# Altium project PCB_Project top.PrjPCB
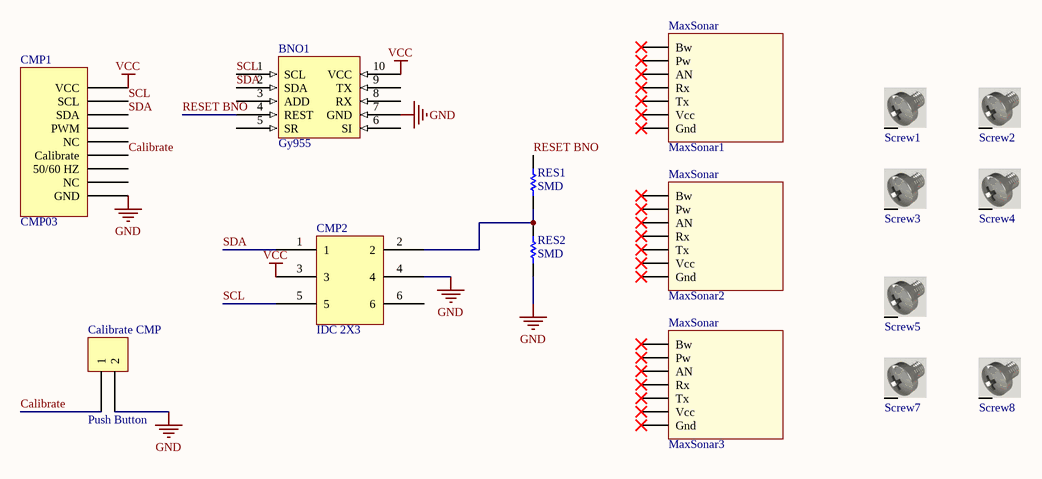
[diagram p0: top.SchDoc]
1 sheet, 16 parts. Net scope: global (net labels, ports and power ports of the same name join across sheets).
Board file: top.PcbDoc

## Sheet top.SchDoc
size A

### Parts
BNO1  Gy955  [DIP10]
Calibrate_CMP  Push Button  [Push Button]
CMP1  CMP03  [CMP03]
CMP2  IDC 2X3  [IDC 2X3]
MaxSonar1  Ultrasonic  [MaxSonar]  (value not drawn)
MaxSonar2  Ultrasonic  [MaxSonar]  (value not drawn)
MaxSonar3  Ultrasonic  [MaxSonar]  (value not drawn)
RES1  SMD  [Resistor SMD 1206]
RES2  SMD  [Resistor SMD 1206]
Screw1  Screw  [Screw]  (value not drawn)
Screw2  Screw  [Screw]  (value not drawn)
Screw3  Screw  [Screw]  (value not drawn)
Screw4  Screw  [Screw]  (value not drawn)
Screw5  Screw  [Screw]  (value not drawn)
Screw7  Screw  [Screw]  (value not drawn)
Screw8  Screw  [Screw]  (value not drawn)

### Nets
GND: BNO1.7(GND) Calibrate_CMP.2 CMP1.9(GND) CMP2.4 RES2.1
VCC: BNO1.10(VCC) CMP1.1(VCC) CMP2.3
Calibrate: Calibrate_CMP.1 CMP1.6(Calibrate)
RESET BNO: BNO1.4(REST) RES1.2
SCL: BNO1.1(SCL) CMP1.2(SCL) CMP2.5
SDA: BNO1.2(SDA) CMP1.3(SDA) CMP2.1
NetCMP2_2: CMP2.2 RES1.1 RES2.2

Not connected (* = marked no-connect by the designer): BNO1 3(ADD) 5(SR) 6(SI) 8(RX) 9(TX); CMP1 4(PWM) 5(NC) 7(50/60_HZ) 8(NC); CMP2 6; MaxSonar1 1(Bw)* 2(Pw)* 3(AN)* 4(Rx)* 5(Tx)* 6(Vcc)* 7(Gnd)*; MaxSonar2 1(Bw)* 2(Pw)* 3(AN)* 4(Rx)* 5(Tx)* 6(Vcc)* 7(Gnd)*; MaxSonar3 1(Bw)* 2(Pw)* 3(AN)* 4(Rx)* 5(Tx)* 6(Vcc)* 7(Gnd)*; Screw1 S; Screw2 S; Screw3 S; Screw4 S; Screw5 S; Screw7 S; Screw8 S

### Library data of the parts
MaxSonar1-MaxSonar3 = MaxSonar
RES1 RES2 = Res SMD
Screw1-Screw5 Screw7 Screw8 = Screw: LatestRevisionDate: 17-Jul-2002; LatestRevisionNote: Re-released for DXP Platform.; Publisher: Altium Limited